# Altium project Thunderbots Buck Converter.PrjPcb
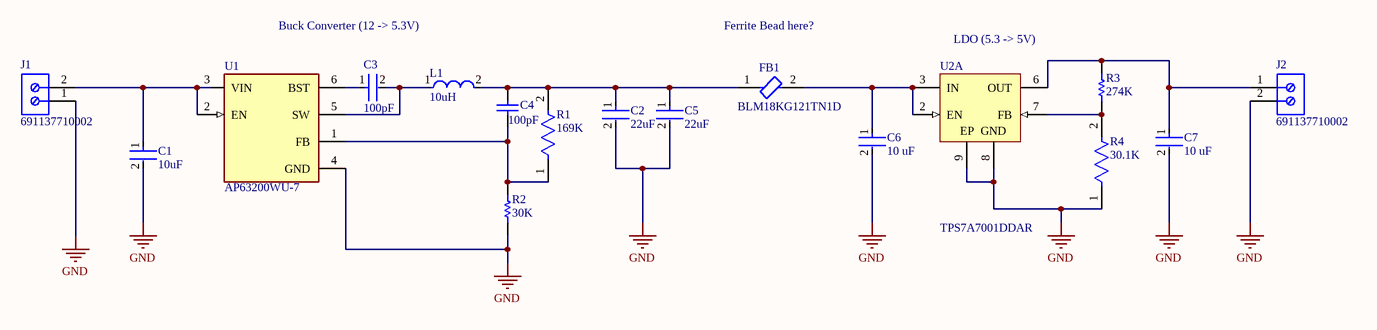
[diagram p0: Thunderbots.SchDoc]
1 sheet, 17 parts. Net scope: global (net labels, ports and power ports of the same name join across sheets).
Board file: Thunderbots.PcbDoc

## Sheet Thunderbots.SchDoc
size A4; SheetNumber: 1; SheetTotal: 1

### Parts
C1  10uF  [FP-RDE3P1-MFG]
C2  22uF  [FP-RDEWK1-MFG]
C3  100pF  [FP-C0402-BB-MFG]
C4  100pF  [CAPC2013X127X50NL20T25]
C5  22uF  [FP-RDEWK1-MFG]
C6  10 uF  [FP-RDE3P1-MFG]
C7  10 uF  [FP-CL05A106MP5NUNC-MFG]
FB1  BLM18KG121TN1D  [FP-BLM18-0_15-t0_6-d1_2-IPC_A]
J1  691137710002  [691137710002]
J2  691137710002  [691137710002]
L1  10uH  [FP-NR6045-MFG]
R1  169K  [FP-RMCF0603-IPC_A]
R2  30K  [RESC1005X40X25LL05T05]
R3  274K  [RESC1005X40X25ML05T05]
R4  30.1K  [FP-ERJ6EN-MFG]
U1  AP63200WU-7  [FP-TSOT26-MFG]
U2  TPS7A7001DDAR  [DDA0008E_M]  (part A of 2)

### Nets
GND: C1.2 C2.2 C5.2 C6.2 C7.2 J1.1 J2.2 R2.1 R4.1 U1.4(GND) U2.8(GND) U2.9(EP)
NetC1_1: C1.1 J1.2 U1.2(EN) U1.3(VIN)
NetC2_1: C2.1 C4.2 C5.1 FB1.1 L1.2 R1.2
NetC3_1: C3.1 U1.6(BST)
NetC3_2: C3.2 L1.1 U1.5(SW)
NetC4_1: C4.1 R1.1 R2.2 U1.1(FB)
NetC6_1: C6.1 FB1.2 U2.2(EN) U2.3(IN)
NetC7_1: C7.1 J2.1 R3.1 U2.6(OUT)
NetR3_2: R3.2 R4.2 U2.7(FB)

### Notes on the sheet
- Buck Converter (12 -> 5.3V)
- Ferrite Bead here?
- LDO (5.3 -> 5V)

### Library data of the parts
C1 C6 = CMP-06035-028282-1: Ceramic Capacitor 10uF ±10% 50V X7S Radial; Lead/Base Style: Kinked; Lead Diameter: 0.5mm; Tolerance: 10%; Capacitance: 10uF; Dielectric: X7S; Height: 5mm; Case/Package: Radial; Voltage Rating: 50V; Min Operating Temperature: -55°C; Max Operating Temperature: 125°C; Width: 0.157inch; Length: 0.217inch; Resistor Type: Ceramic; Height - Seated (Max): 0.295inch; Lead Pitch: 0.098inch; Voltage Rating (DC): 50V; Package Quantity: 1500; Mount: Through Hole; Termination: Radial; Packaging: Tape and Reel
C2 C5 = CMP-06035-003638-1: CAP CER 22UF 50V X7S RADIAL; Lead/Base Style: Formed Leads; Tolerance: 20%; Mount: Through Hole; Max Operating Temperature: 125°C; Capacitance: 22uF; Packaging: Bulk; Voltage Rating: 50V; Min Operating Temperature: -55°C; Case/Package: Radial
C3 = CMP-2008-03086-2: CAP CER 0.1UF 10V X7R 0402; Manufacturer Part Number: C0402C104K8RACTU; Manufacturer: Kemet; Description: C0402 0.10 μF X7R 10.00% 10 V; Capacitance: 0.10 μF; Tolerance: 0.1; Temperature Coefficient: 15%; Value: 0.10 μF; Material: Ceramic; Automotive: No; Temperature Range High: +125°C; Octopart: https://octopart.com/c0402c104k8ractu-kemet-106349; ComponentLink2Description: Datasheet; ComponentLink2URL: https://content.kemet.com/datasheets/KEM_C1002_X7R_SMD.pdf; Temperature: -55°C to +125°C; RoHS: TRUE; Temperature Range Low: -55°C; Temperature Characteristic: X7R; Lead Free: Yes; Height: 0.55mm; Voltage Rating: 10 V; Category: Cap; Device Class L3: Ceramic Capacitors; Digikey Description: CAP CER 0.1UF 10V X7R 0402; Package: C0402-BB; Device Class L1: Passive Components; Ipc Land Pattern Name: CAPC10050X50; Mouser Description: Multilayer Ceramic Capacitors MLCC - SMD/SMT 10volts 0.1uF X7R 10%; Device Class L2: Capacitors
C4 = CMP-2007-04832-1: Part Number: 08052C101KAT2A; Manufacturer: AVX Interconnect / Elco
C7 = CMP-13271-000002-1: CAP CER 10UF 10V X5R 0402; Manufacturer Part Number: CL05A106MP5NUNC; Manufacturer: Samsung; Temperature Coefficient: 15%; Tolerance: 20%; Description: Cap Ceramic 10uF 10V X5R 20% SMD 0402 85C T/R; Material: Ceramic; Octopart: https://octopart.com/cl05a106mp5nunc-samsung-22457395; Voltage Rating: 10V; RoHS: TRUE; Value: 10uF; Height: 0.7mm; Digikey Description: CAP CER 10UF 10V X5R 0402; Automotive: No; Package: CL05A106MP5NUNC; Device Class L1: Passive Components; Capacitance: 10uF; Temperature Range High: +85°C; ComponentLink2Description: Datasheet; Device Class L2: Capacitors; Temperature Characteristic: X5R; Temperature: -55°C to +85°C; ComponentLink2URL: http://www.samsungsem.com/kr/support/product-search/mlcc/__icsFiles/afieldfile/2019/05/10/19-CL05A106MP5NUNC.pdf; Device Class L3: Ceramic Capacitors; Category: Cap; Temperature Range Low: -55°C; Ipc Land Pattern Name: CAPC10050X50; Lead Free: Yes
FB1 = CMP-0686-00554-8: FERRITE BEAD 120 OHM 0603 1LN; Max Current Rating: 3A; DC Resistance (DCR): 30mR; Impedance: 120R; Number of Lines: 1; Test Frequency: 100MHz; Tolerance: 25%; Package Quantity: 4000; Min Operating Temperature: -55°C; Termination: SMD/SMT; REACH SVHC: No SVHC; Core Material: Ferrite; Material: Ferrite; Current Rating: 3A; Height: 0.8mm; Number of Pins: 2; Case/Package: 0603; Case Code (Imperial): 0603; Series: BLM18K; Packaging: Tape and Reel; Inductor Type: FERRITE BEAD; Lead Free: Lead Free; Width: 0.8mm; Case Code (Metric): 1608; Number of Circuits: 1; Max DC Current: 3A; Depth: 0.95mm; Max Operating Temperature: 125°C; Length: 1.6mm; RoHS Compliant: Yes
J1 J2 = CMP-1502-03324-2: NexarPartId: 78871135; Voltage Rating: 300V; Number of Contacts: 2; Current Rating: 16A; Lead Pitch: 5mm; Height: 11.6mm; Packaging: Box; RoHS: Non-Compliant; Contact Material: Nickel, Tin; Max Operating Temperature: 120°C; Number of Pins: 2; Min Operating Temperature: -30°C; Number of Rows: 1
L1 = CMP-14484-001000-1: Shielded Wirewound Inductor 10uH 20% 2.5A 61.1mΩ SMD; Test Frequency: 100kHz; Self Resonant Frequency: 12MHz; DC Resistance (DCR): 61.1mR; Saturation Current: 3A; Core Material: Ferrite; RMS Current (Irms): 2.5A; Packaging: Tape and Reel; Resistor Type: Wirewound; Height: 4.5mm; Inductance: 10uH; Max DC Current: 2.5A; Width: 6mm; Mount: Surface Mount; Height - Seated (Max): 0.177inch; Termination: SMD/SMT; Halogen Free: Halogen Free; Min Operating Temperature: -25°C; Max Operating Temperature: 120°C; RoHS Compliant: Yes; Tolerance: 20%; Case/Package: 2424; Series: NR; Number of Pins: 2; Inductance Tolerance: 20%; Length: 0.236inch; Current Rating: 2.5A; Package Quantity: 1500; Shielding: Shielded
R1 = CMP-26527-003409-1: 169kΩ ±1% 0.1W 0603 Thick Film Chip Resistor AEC-Q200 compliant; Temperature Coefficient: 100ppm/°C; Power Rating: 100mW; Resistance: 169kR; Lead Free: Lead Free; Case Code (Imperial): 0603; Min Operating Temperature: -55°C; RoHS Compliant: Yes; Mount: Surface Mount; Height: 0.022inch; Max Operating Temperature: 155°C; Packaging: Tape and Reel; Tolerance: 1%; Contact Plating: Tin; Case Code (Metric): 1608; Series: RMCF; Radiation Hardening: No; Length: 0.061inch; Features: Automotive AEC-Q200; Max Power Dissipation: 100mW; Resistor Type: Thick Film; Number of Terminations: 2; Case/Package: 0603; Width: 0.031inch; Size Code: 0603
R2 = CMP-1011-00675-2: Part Number: CRCW040230K0FKED; Manufacturer: Vishay Dale
R3 = CMP-2002-00829-1: Manufacturer: Panasonic; Part Number: ERJ-2RKF2743X
R4 = CMP-2001-00114-2: NexarPartId: 55405038; Voltage Rating: 150V; Temperature Coefficient: 100ppm/°C; Resistance: 30.1kΩ; Max Power Dissipation: 125mW; Tolerance: 1%; Lead Free: Lead Free; Number of Terminations: 2; Min Operating Temperature: -55°C; Composition: Thick Film; Packaging: Cut Tape (CT); Radiation Hardening: No; Width: 1.2446mm; Termination: SMD/SMT; Schedule B: 8533210045, 8533210045; Lifecycle Status: Production; Depth: 1.25mm; Case Code (Metric): 2012; Length: 2mm; Contact Plating: Tin; Max Operating Temperature: 155°C; REACH SVHC: No SVHC; Height: 600µm; Mount: Surface Mount; Case/Package: 0805; Voltage Rating (DC): 150V; RoHS: Compliant; Case Code (Imperial): 0805; Power Rating: 125mW; Military Standard: Not; Features: Automotive AEC-Q200
U1 = CMP-12757-000010-1: IC REG BUCK ADJUSTABLE 2A TSOT26; Manufacturer: Diodes Inc.; Switching Frequency: 500kHz; Max Supply Voltage: 32V; Number Of Outputs: 1; Nominal Supply Current: 22uA; Min Supply Voltage: 3.8V; Output Type: AdjustableProgrammable; Max Junction Temp: +160°C; Standoff Height: 0.01mm; Octopart: https://octopart.com/ap63200wu-7-diodes+inc.-98099548; Height: 1mm; Temperature Range Low: -40°C; Output Current: 2A; ComponentLink2URL: https://www.diodes.com/assets/Datasheets/AP63200-AP63201-AP63203-AP63205.pdf; Switching Topology: Buck; Automotive: No; Device Class L1: Integrated Circuits (ICs); Ipc Land Pattern Name: SOT95P280X100-6; Package: TSOT26; Temperature Range High: +85°C; RoHS: TRUE; Ambient Temperature Range High: +85°C; Device Class L3: Voltage Regulators - Switching; Temperature: -40°C to +85°C; Device Class L2: Power Management ICs; Footprint Url: https://www.diodes.com/assets/Package-Files/TSOT26.pdf; Mouser Description: AP63200 Series 1.2 V 2 A Adjustable Synchronous Buck Converter - TSOT-26; Category: IC; ComponentLink2Description: Datasheet; Digikey Description: IC REG BUCK ADJUSTABLE 2A TSOT26; Lead Free: Yes; Ambient Temperature Range Low: -40°C; Manufacturer Part Number: AP63200WU-7
U2 = CMP-0395-00550-2: Single Output Very Low Input LDO, 2 A, Adjustable 0.9 to 5 V Output, 1.5 to 6.5 V Input, 8-pin SOPowerPAD (DDA), -40 to 125 degC, Green (RoHS & no Sb/Br); Manufacturer: Texas Instruments; Iq(Typ)(mA): 0.01; Vin(Max)(V): 6.5; Accuracy(%): 2; Vin(Min)(V): 1.5; Vout Adj(Max)(V): 5; Vout Adj(Min)(V): 0.9; SubFamily: Single Channel LDO; Vdo(Typ)(mV): 170; PartNumber: TPS7A7001DDAR; Mounting Technology: Surface Mount; ComponentLink3Description: Package Specification; ComponentLink2Description: Datasheet; DatasheetVersion: SBVS134B; PackageReference: DDA0008E; PackageVersion: 4202561/F; ComponentLink1Description: Manufacturer URL; Eco-Plan: Green (RoHS & no Sb/Br); Iout(Max)(A): 2; Code_JEDEC: MS-012; ComponentLink1URL: http://www.ti.com/; ComponentLink3URL: http://www.ti.com/litv/pdf/mpds092e; PackageDescription: 8-Pin Plastic Small Outline, Body 3.9 x 4.9 mm, Pitch 1.27 mm; ComponentLink2URL: http://www.ti.com/general/docs/lit/getliterature.tsp?genericPartNumber=TPS7A7001&fileType=pdf